# Altium project FX3U-14MR.PrjPcb (part 1 of 2)
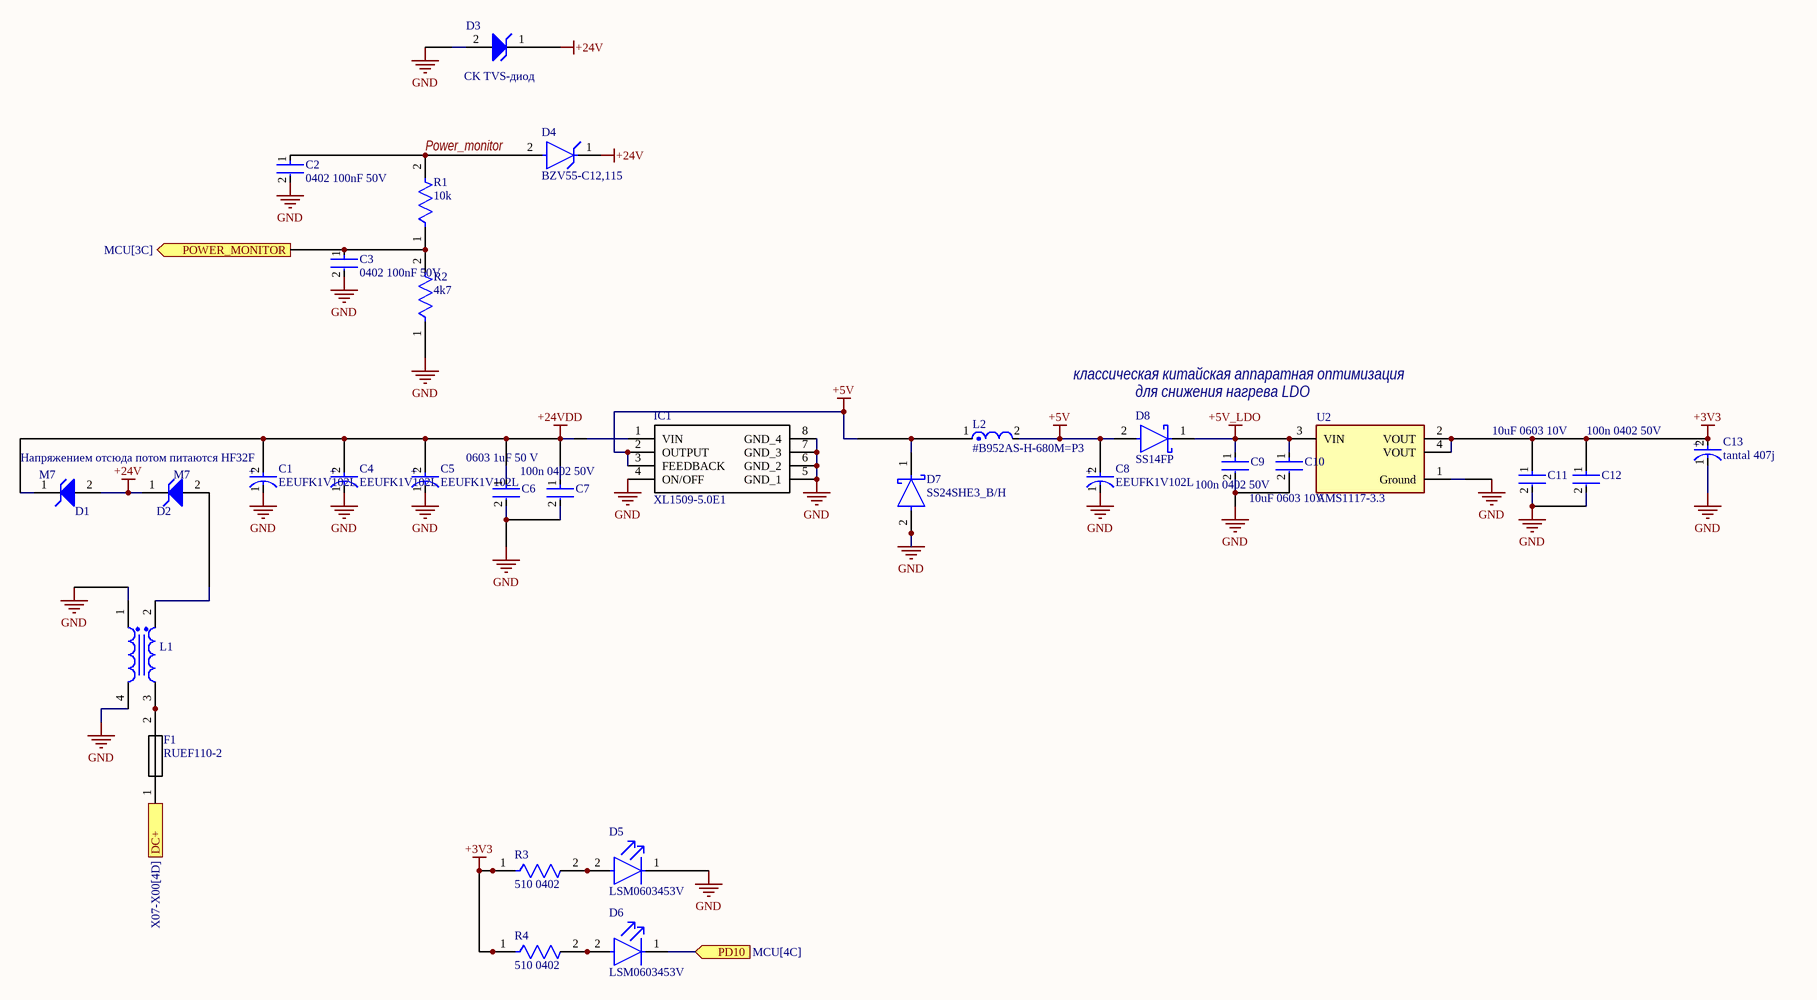
[diagram p0: Power_Supply.SchDoc]
6 sheets, 176 parts. Net scope: flat (ports and power ports of the same name join across sheets).
Board files: PCB.PcbDoc, PCB2.PcbDoc
Sheets:
  Power_Supply.SchDoc
  MCU.SchDoc
  RS232.SchDoc
  ULN2003.SchDoc
  DA0-1_AD0-AD5.SchDoc
  X07-X00.SchDoc

## Sheet Power_Supply.SchDoc
size A2; SheetNumber: 1; SheetTotal: 6

### Parts
C1  EEUFK1V102L  [FP-RAD-TH-D_10_0_5-L_30_2-MFG]
C2  0402 100nF 50V  [FP-0402B104K500CT-IPC_C]
C3  0402 100nF 50V  [FP-0402B104K500CT-IPC_C]
C4  EEUFK1V102L  [FP-RAD-TH-D_10_0_5-L_30_2-MFG]
C5  EEUFK1V102L  [FP-RAD-TH-D_10_0_5-L_30_2-MFG]
C6  0603 1uF 50 V  [FP-CC0603-DB-MFG]
C7  100n 0402 50V  [FP-0402B104K500CT-IPC_C]
C8  EEUFK1V102L  [FP-RAD-TH-D_10_0_5-L_30_2-MFG]
C9  100n 0402 50V  [FP-0402B104K500CT-IPC_C]
C10  10uF 0603 10V  [FP-C0603C106M8PACTU-MFG]
C11  10uF 0603 10V  [FP-C0603C106M8PACTU-MFG]
C12  100n 0402 50V  [FP-0402B104K500CT-IPC_C]
C13  tantal 407j  [FP-TPSB-MFG]
D1  M7  [WE-TVSP_DO-214AC_Unidirectional]
D2  M7  [WE-TVSP_DO-214AC_Unidirectional]
D3  CK TVS-диод  [WE-TVSP_DO-214AC_Unidirectional]
D4  BZV55-C12,115  [FP-SOD80C-MFG]
D5  LSM0603453V  [FP-LSM0603453V-MFG]
D6  LSM0603453V  [FP-LSM0603453V-MFG]
D7  SS24SHE3_B/H  [FP-95400-MFG]
D8  SS14FP  [FP-425AC-MFG]
F1  RUEF110-2  [RUEF1102]
IC1  XL1509-5.0E1  [SOIC127P600X175-8N]
L1  12mH  [WE-TFC_UU9.8V]  (value not drawn)
L2  #B952AS-H-680M=P3  [FP-DS104C2-MFG]
R1  10k  [FP-RT0603-MFG]
R2  4k7  [FP-MCR01-IPC_A]
R3  510 0402  [FP-RMCF0402-MFG]
R4  510 0402  [FP-RMCF0402-MFG]
U2  AMS1117-3.3  [FP-AMS1117-IPC_B]

### Ports
DC+ (in, see X07-X00[4D]), PD10 (in, see MCU[4C]), POWER_MONITOR (out, see MCU[3C])

### Nets
+3V3: C11.1 C12.1 C13.2(A) R3.1 R4.1 U2.2(VOUT) U2.4(VOUT)
+5V: C8.2(A) D7.1(C) D8.2(A) IC1.2(OUTPUT) IC1.3(FEEDBACK) L2.1 L2.2
+5V_LDO: C9.1 C10.1 D8.1(C) U2.3(VIN)
+24V: D1.2(A) D2.1(K) D3.1(K) D4.1(C)
+24VDD: C1.2(A) C4.2(A) C5.2(A) C6.1 C7.1 D1.1(K) IC1.1(VIN)
GND: C1.1(C) C2.2 C3.2 C4.1(C) C5.1(C) C6.2 C7.2 C8.1(C) C9.2 C10.2 C11.2 C12.2 C13.1(C) D3.2(A) D5.1(C) D7.2(A) IC1.4(ON/OFF) IC1.5(GND_1) IC1.6(GND_2) IC1.7(GND_3) IC1.8(GND_4) L1.1 L1.4 R2.1 U2.1(Ground)
Power_monitor: C2.1 D4.2(A) R1.2
NetC3_1: C3.1 R1.1 R2.2 ; port POWER_MONITOR
NetD2_2: D2.2(A) L1.2
NetD5_2: D5.2(A) R3.2
NetD6_1: D6.1(C) ; port PD10
NetD6_2: D6.2(A) R4.2
NetF1_1: F1.1 ; port DC+
NetF1_2: F1.2 L1.3

### Notes on the sheet
- классическая китайская аппаратная оптимизация
- для снижения нагрева LDO
- (near C1) Напряжением отсюда потом питаются HF32F
- (in symbol CMP-04424-000211-1) +
- (in symbol CMP-05427-000707-1) +

### Library data of the parts
C1 C4 C5 C8 = CMP-05427-000707-1: Aluminum Electrolytic Capacitors (Radial Lead Type) AEC-Q200 Qualified 1000uF ±20% 35V; Lead/Base Style: Straight; Ripple Current: 2.14A; Lead Diameter: 0.6mm; Dissipation Factor: 0.12%; Capacitance: 1mF; Life (Hours): 4000Hour; Dielectric Material: Aluminium; Tolerance: 20%; Height: 30mm; Max Operating Temperature: 105°C; Radiation Hardening: No; Voltage: 35V; Construction: RADIAL; Termination: Radial; Packaging: Bulk; Case/Package: Radial; Package Quantity: 100; Series: FK; Contact Plating: Tin; Voltage Rating (DC): 35V; Mount: Through Hole; RoHS Compliant: Yes; Diameter: 10mm; Lead Pitch: 5mm; REACH SVHC: No SVHC; Min Operating Temperature: -55°C; Voltage Rating: 35V; Length: 30mm
C2 C3 = CMP-45632-000010-1: CAP CER 0.1UF 50V X7R 0402; Tolerance: 10%; Max Operating Temperature: 125°C; Case Code (Metric): 1005; RoHS Compliant: Yes; Series: -; Case Code (Imperial): 0402; Voltage Rating: 50V; Min Operating Temperature: -55°C; Mount: Surface Mount; Capacitance: 100nF; Case/Package: 0402; Packaging: Cut Tape
C6 = CMP-03422-000761-2: CAP CER 1UF 50V X7R 0603; Tolerance: 10%; Lead Free: Lead Free; Max Operating Temperature: 125°C; Width: 0.031inch; Voltage Rating: 50V; Mount: Surface Mount; Resistor Type: Ceramic; Halogen Free: Halogen Free; Weight: 7.1E-05oz; Voltage Rating (DC): 50V; Package Quantity: 4000; Termination: SMD/SMT; Length: 0.063inch; Min Operating Temperature: -55°C; Dielectric: X7R; Case Code (Metric): 1608; Case Code (Imperial): 0603; Packaging: Tape and Reel; Thickness: 0.035inch; Capacitance: 1uF; Case/Package: 0603
C7 C9 C12 = CMP-45632-000010-1: CAP CER 0.1UF 50V X7R 0402; Tolerance: 10%; Capacitance: 100nF; Max Operating Temperature: 125°C; Case Code (Metric): 1005; RoHS Compliant: Yes; Series: -; Case Code (Imperial): 0402; Voltage Rating: 50V; Min Operating Temperature: -55°C; Mount: Surface Mount; Case/Package: 0402; Packaging: Cut Tape
C10 C11 = CMP-03020-034654-1: CAP CER 10UF 10V X5R 0603; RoHS Compliant: Yes
C13 = CMP-04424-000211-1: CAP TANT 100UF 10% 6.3V 1411; Dielectric Material: Tantalum; Leakage Current: 6.3uA; ESR (Equivalent Series Resistance): 400mR; Polarity: Polar; Packaging: Tape and Reel; Lead Free: Lead Free; RoHS Compliant: Yes; Case/Package: 1210; Mount: Surface Mount; Case Code (Metric): 3528; Depth: 2.8mm; Voltage Rating: 6.3V; REACH SVHC: No SVHC; Tolerance: 10%; Max Operating Temperature: 125°C; Package Quantity: 1; Height - Seated (Max): 0.083inch; Min Operating Temperature: -55°C; Case Code (Imperial): 1210; Capacitance: 100uF; Length: 3.5mm; Termination: SMD/SMT; Features: General Purpose; Voltage Rating (DC): 6.3V; Weight: 0.000564oz; Width: 0.11inch; Voltage: 6.3V; Construction: Flat; Series: TPS; Radiation Hardening: No; Height: 1.9mm; Dissipation Factor: 10%
D1 D2 = CMP-03913-71101534-2: Trans Voltage Suppressor Diode, 400W, Unidirectional, 1 Element, Silicon, DO-214AC; Clamping Voltage: 12V; Breakdown Voltage: 8.19V; Power Line Protection: No; Peak Pulse Current: 33.3A; Leakage Current: 200µA; Number of Unidirectional Channels: 1; Reverse Standoff Voltage: 7V; Peak Pulse Power: 400W; Max Operating Temperature: 150°C; Mount: Surface Mount; RoHS: Compliant; Min Breakdown Voltage: 8.19V; Composition: Zener; Min Operating Temperature: -65°C; Length: 4.24mm; Width: 2.67mm; Number of Pins: 2; REACH SVHC: Unknown; Max Breakdown Voltage: 8.19V; Packaging: Cut Tape; Polarity: Unidirectional; Height: 2.25mm
D3 = CMP-03913-71101519-2: TVS diode [Würth Elektronik] 824500281 TVS diode; Clamping Voltage: 45.4V; Polarity: Unidirectional; Reverse Standoff Voltage: 28V; Max Breakdown Voltage: 32.75V; Peak Pulse Power: 400W; Number of Unidirectional Channels: 1; Power Line Protection: No; Peak Pulse Current: 8.8A; Leakage Current: 1µA; Mount: Surface Mount; RoHS: Compliant; Composition: Zener; Number of Pins: 2; Packaging: Cut Tape; Height: 2.25mm; Max Operating Temperature: 150°C; Min Breakdown Voltage: 32.75V; Breakdown Voltage: 32.75V; REACH SVHC: Unknown; Length: 4.24mm; Min Operating Temperature: -65°C; Width: 2.67mm
D4 = CMP-14400-000013-1: DIODE ZENER 12V 500MW SOD80C; Manufacturer: Nexperia; Zener Impedance: 10Ω; Max Zener Voltage: 12.7V; Max Reverse Leakage Current: 0.1uA; Max Junction Temp: +200°C; Power Dissipation: 400mW; Forward Current: 250mA; Reverse Voltage: 8V; Device Class L1: Discrete Semiconductors; Octopart: https://octopart.com/bzv55-c12%2C115-nexperia-78739834; ComponentLink2Description: Datasheet; Automotive: No; ComponentLink2URL: https://assets.nexperia.com/documents/data-sheet/BZV55_SER.pdf; Height: 1.6mm; Lead Free: Yes; Temperature Range Low: -65°C; Mouser Description: Diode Zener Single 12.05V 5% 500mW 2-Pin Mini-MELF T/R; Device Class L3: Zener Diodes; Device Class L2: Diodes; Category: Diode; Package: SOD80C; Manufacturer Part Number: BZV55-C12,115; Footprint Url: https://assets.nexperia.com/documents/outline-drawing/SOD80C.pdf; RoHS: TRUE; Temperature Range High: +200°C; Digikey Description: DIODE ZENER 12V 500MW SOD80C; Nom Zener Voltage: 12V; Temperature: -65°C to +200°C
D5 D6 = CMP-00731-94024739-1: LSM0603453V LED SM 0603 3V -/1000/-mcd Green; Forward Current: 20mA; Forward Voltage: 2.3V; Viewing Angle: 120°; Reverse Voltage: 5V; Power Dissipation: 60mW; Wavelength: 576nm; Luminous Intensity: 120mcd; NexarPartId: 94024739; Height: 550µm; Max Operating Temperature: 85°C; Schedule B: 8541402000, 8541406050; Case/Package: 0603; Color: Green; Min Operating Temperature: -40°C
D7 = CMP-02539-000047-1: DIODE SCHOTTKY 2A 40V DO-214AC; RoHS Compliant: Yes
D8 = CMP-00278-84331602-1: SS14FP Diode Schottky 40V 1A 2-Pin SOD-123HE T/R - Tape and Reel; Manufacturer Lifecycle Status: ACTIVE; Max Junction Temperature (Tj): 150°C; Element Configuration: Single; Capacitance: 54pF; Max Forward Surge Current (Ifsm): 30A; Peak Reverse Current: 400µA; Reverse Recovery Time: 6ns; RoHS: Compliant; Min Operating Temperature: -55°C; Max Operating Temperature: 150°C; Lifecycle Status: Production; Forward Current: 1A; Average Rectified Current: 1A; Mount: Surface Mount; Height: 1mm; Max Repetitive Reverse Voltage (Vrrm): 40V; Weight: 18.4mg; NexarPartId: 84331602; Max Reverse Voltage (DC): 40V; Reverse Voltage: 40V; Schedule B: 8541100080, 8541100080
F1 = RUEF110-2: Fuse; Manufacturer_Name: LITTELFUSE; Datasheet Link: https://www.littelfuse.com/~/media/electronics/product_specifications/resettable_ptcs/littelfuse_ptc_ruef110_product_specification.pdf.pdf; Height: 14.2mm; Manufacturer_Part_Number: RUEF110-2; Mouser Part Number: 650-RUEF110-2; Mouser Price/Stock: https://www.mouser.co.uk/ProductDetail/Littelfuse/RUEF110-2?qs=k5V78Jg%2Feq5PDttMRR0ePQ%3D%3D; Arrow Part Number: RUEF110-2; Arrow Price/Stock: https://www.arrow.com/en/products/ruef110-2/littelfuse?region=nac
IC1 = XL1509-5.0E1: Integrated Circuit; Manufacturer_Name: XLSEMI; Datasheet Link: https://datasheet.lcsc.com/szlcsc/XLSEMI-XL1509-5-0E1_C61063.pdf; Height: 1.75mm; Manufacturer_Part_Number: XL1509-5.0E1
L1 = 744862120: WE-TFC THT Common Mode Power Line Choke, UU9.8V, 12mH, 0.4A, 2Ω; Manufacturer: Wurth Elektronik; Insulation Test Voltage (AC): 2500V; Material: MnZn; Rated Voltage (AC): 300V; ComponentLink1Description: Manufacturer Link; ComponentLink1URL: https://www.we-online.com/redexpert/article/744862120?ad; ComponentLink2Description: Datasheet; ComponentLink2URL: https://www.we-online.com/redexpert/spec/744862120?ad; Manufacturer Part Number: 744862120; Category: Common Mode Chokes; Match Code: WE-TFC; Mount: Through Hole; Operating Temperature Max: 125°C; Operating Temperature Min: -40°C; Packaging: Tray; Case/Size Code: UU9.8V; Length: 17mm; Width: 11.5mm; Height: 17mm; DC Resistance Max: 2Ω; Inductance: 12mH; Rated Current: 0.4A
L2 = CMP-06042-010777-1: Shielded Wirewound Inductor 68uH 20% 1100mA 0.24Ω SMD; Current Rating: 1.1A; Core Material: Ferrite; Test Frequency: 100kHz; DC Resistance (DCR): 240mR; Saturation Current: 1.3A; Width: 0.409inch; Packaging: Tape and Reel; Inductance: 68uH; Max Operating Temperature: 85°C; Case/Package: Nonstandard; Tolerance: 20%; Resistor Type: Wirewound; Mount: Surface Mount; Length: 0.409inch; Min Operating Temperature: -40°C; Height - Seated (Max): 0.19inch; Shielding: Shielded
R1 = CMP-03412-024743-1: RES SMD 10K OHM 0.05% 1/10W 0603; Manufacturer: Yageo; Manufacturer Part Number: RT0603WRE0710KL; Power Rating: 0.1W; Value: 10KΩ; Voltage Rating: 75V; Tolerance: 0.0005; Temperature Coefficient: 50 ppm/°C; Height: 0.55mm; ComponentLink2URL: http://www.yageo.com/documents/recent/PYu-RT_1-to-0.01_RoHS_L_9.pdf; Mouser Description: Res SMD 10K Ohm 0.05% 1/10W 0603; Device Class L1: Passive Components; Octopart: https://octopart.com/rt0603wre0710kl-yageo-71396825; Lead Free: Yes; RoHS: TRUE; ComponentLink2Description: Datasheet; Package: RT0603; Ipc Land Pattern Name: RESC16080X45; Automotive: No; Temperature: -55°C to +155°C; Series: RT; Resistance: 10KΩ; Footprint Url: http://www.yageo.com/exep/pages/download/literatures/PYu-R_Mount_10.pdf; Temperature Range Low: -55°C; Digikey Description: RES SMD 10K OHM 0.05% 1/10W 0603; Category: Res; Device Class L3: Chip SMD Resistors; Temperature Range High: +155°C; Device Class L2: Resistors; Composition: Thin Film
R2 = CMP-08839-002316-1: Thick Film Chip Resistor, 0402, 4.7kΩ, 1%, 100ppm/°C, 0.063W, 50V
R3 R4 = CMP-26527-001818-1: 510Ω ±1% 0.063W 0402 Thick Film Chip Resistor AEC-Q200 compliant; Temperature Coefficient: 100ppm/°C; Max Power Dissipation: 63mW; Resistance: 510R; Series: RMCF; RoHS Compliant: Yes; Features: Automotive AEC-Q200; Contact Plating: Tin; Case Code (Imperial): 0402; Package Quantity: 10000; Max Operating Temperature: 155°C; Height: 0.016inch; Length: 0.039inch; Width: 0.02inch; Number of Terminations: 2; Packaging: Tape and Reel; Mount: Surface Mount; Tolerance: 1%; Min Operating Temperature: -55°C; Case/Package: 0402; Case Code (Metric): 1005; Resistor Type: Thick Film
U2 = CMP-209535-000001-1: LDO Voltage Regulators 1A, 3.3V; Manufacturer: Advanced Monolithic Systems; Dropout Voltage: 1.1V; Output Type: Fixed; Nominal Supply Current: 5mA; Max Power Dissipation: 1.2W; Max Supply Voltage: 15V; Number Of Outputs: 1; Standoff Height: 0.64mm; Max Junction Temp: +125°C; Height: 1.8mm; Package: AMS1117; Device Class L2: Power Management ICs; ComponentLink2Description: Datasheet; ComponentLink2URL: http://www.advanced-monolithic.com/pdf/ds1117.pdf; Category: IC; RoHS: TRUE; Automotive: No; Device Class L1: Integrated Circuits (ICs); Output Current: 1A; Device Class L3: Voltage Regulators - Linear; Temperature: -40°C to +125°C; Output Voltage: 3.3V; Manufacturer Part Number: AMS1117-3.3; Temperature Range Low: -40°C; Octopart: https://octopart.com/ams1117-3.3-advanced+monolithic+systems-25899300; Lead Free: Yes; Ipc Land Pattern Name: SOT229P700X180-4; Temperature Range High: +125°C

## Sheet MCU.SchDoc
size A3; SheetNumber: 2; SheetTotal: 6
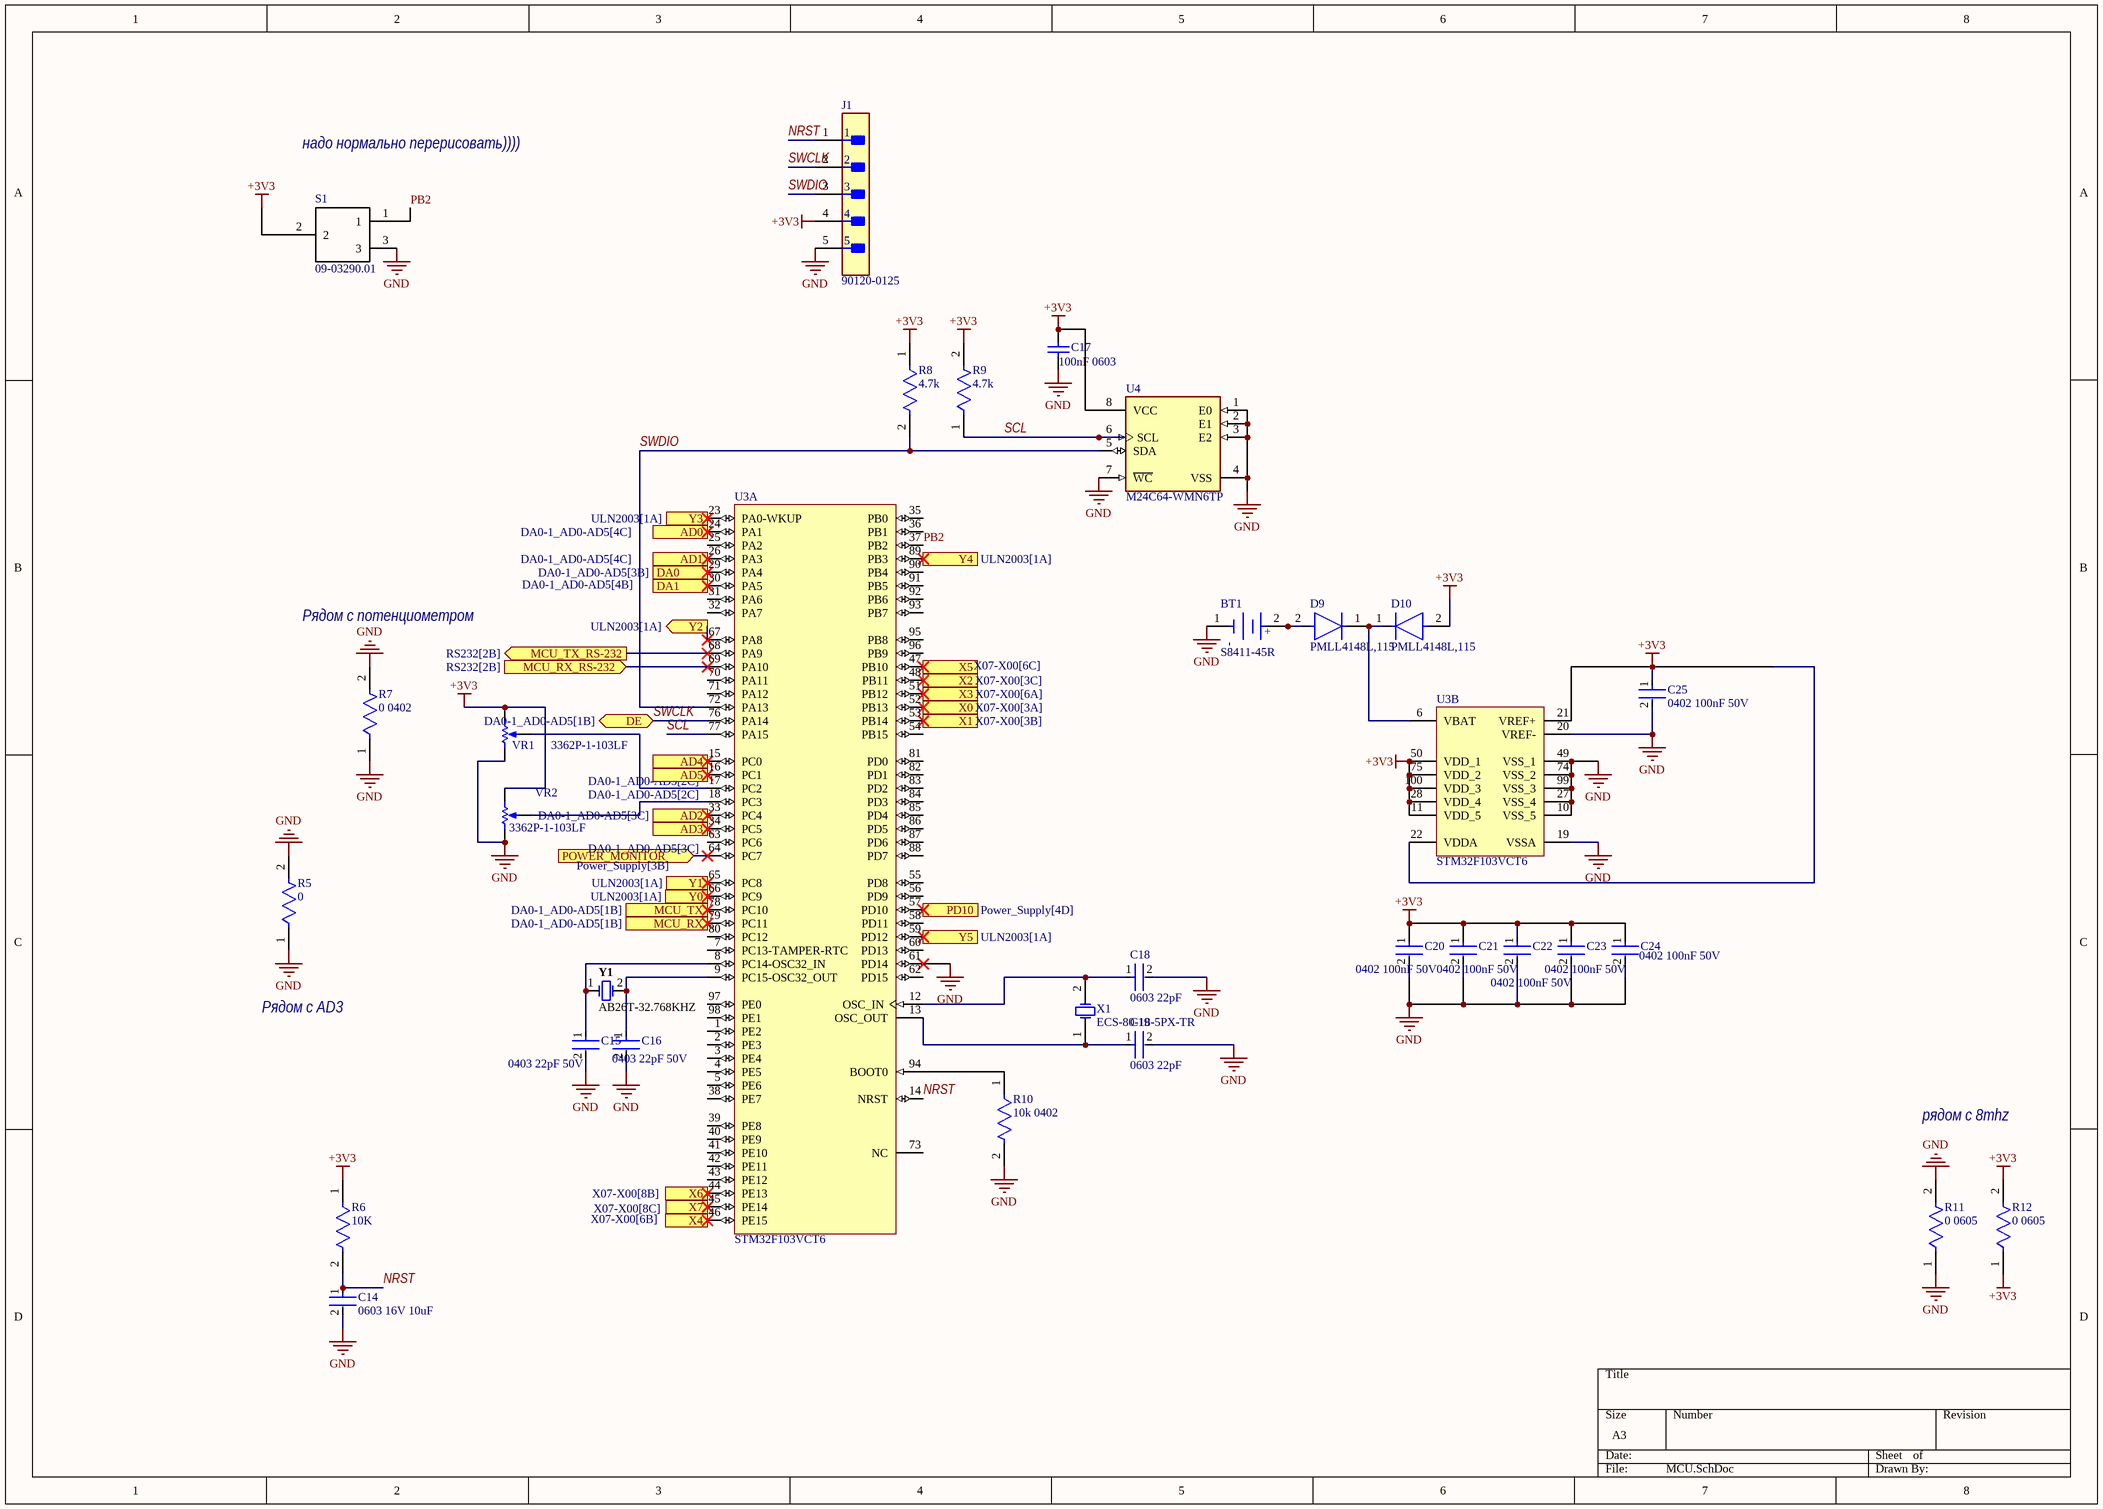
[diagram p1: MCU.SchDoc]

### Parts
BT1  S8411-45R  [FP-S8411-45R-MFG]
C14  0603 16V 10uF  [FP-CC0603-DC-MFG]
C15  0403 22pF 50V  [FP-C0402-BB-MFG]
C16  0403 22pF 50V  [FP-C0402-BB-MFG]
C17  100nF 0603  [CAPC1608X90X35LL15T15]
C18  0603 22pF  [FP-C0603C-CF-MFG]
C19  0603 22pF  [FP-C0603C-CF-MFG]
C20  0402 100nF 50V  [FP-0402B104K500CT-IPC_C]
C21  0402 100nF 50V  [FP-0402B104K500CT-IPC_C]
C22  0402 100nF 50V  [FP-0402B104K500CT-IPC_C]
C23  0402 100nF 50V  [FP-0402B104K500CT-IPC_C]
C24  0402 100nF 50V  [FP-0402B104K500CT-IPC_C]
C25  0402 100nF 50V  [FP-0402B104K500CT-IPC_C]
D9  PMLL4148L,115  [FP-SOD80C-MFG]
D10  PMLL4148L,115  [FP-SOD80C-MFG]
J1  90120-0125  [FP-90120-0125-MFG]
R5  0  [FP-RCS0603-e3-MFG]
R6  10K  [FP-RT0603-MFG]
R7  0 0402  [FP-PMR01-MFG]
R8  4.7k  [FP-TFCR0402-IPC_A]
R9  4.7k  [FP-TFCR0402-IPC_A]
R10  10k 0402  [FP-MCS0402-MFG]
R11  0 0605  [FP-HCJ0603-MFG]
R12  0 0605  [FP-HCJ0603-MFG]
S1  09-03290.01  [09.03290.01]
U3  STM32F103VCT6  [STM-LQFP100_L]  (parts A,B of 2)
U4  M24C64-WMN6TP  [FP-SO8N-SO-A-MFG]
VR1  3362P-1-103LF  [BOUR-3362P]
VR2  3362P-1-103LF  [BOUR-3362P]
X1  ECS-80-18-5PX-TR  [ECS-80-18-5PX-TR_V]
Y1  AB26T-32.768KHZ  [ABRA-AB26T]

### Ports
AD0 (in, see DA0-1_AD0-AD5[4C]), AD1 (in, see DA0-1_AD0-AD5[4C]), AD2 (in, see DA0-1_AD0-AD5[3C]), AD3 (in, see DA0-1_AD0-AD5[3C]), AD4 (in, see DA0-1_AD0-AD5[2C]), AD5 (in, see DA0-1_AD0-AD5[2C]), DA0 (out, see DA0-1_AD0-AD5[3B]), DA1 (out, see DA0-1_AD0-AD5[4B]), DE (bidir, see DA0-1_AD0-AD5[1B]), MCU_RX (in, see DA0-1_AD0-AD5[1B]), MCU_RX_RS-232 (in, see RS232[2B]), MCU_TX (out, see DA0-1_AD0-AD5[1B]), MCU_TX_RS-232 (out, see RS232[2B]), PD10 (out, see Power_Supply[4D]), POWER_MONITOR (in, see Power_Supply[3B]), X0 (in, see X07-X00[3A]), X1 (in, see X07-X00[3B]), X2 (in, see X07-X00[3C]), X3 (in, see X07-X00[6A]), X4 (in, see X07-X00[6B]), X5 (in, see X07-X00[6C]), X6 (in, see X07-X00[8B]), X7 (in, see X07-X00[8C]), Y0 (out, see ULN2003[1A]), Y1 (out, see ULN2003[1A]), Y2 (out, see ULN2003[1A]), Y3 (out, see ULN2003[1A]), Y4 (out, see ULN2003[1A]), Y5 (out, see ULN2003[1A])

### Nets
+3V3: C17.2 C20.1 C21.1 C22.1 C23.1 C24.1 C25.1 D10.2(A) J1.4 R6.1 R8.1 R9.2 R12.1 R12.2 S1.2 U3.11(VDD_5) U3.21(VREF+) U3.22(VDDA) U3.28(VDD_4) U3.50(VDD_1) U3.75(VDD_2) U3.100(VDD_3) U4.8(VCC) VR1.3(CW) VR2.3(CW)
GND: BT1.1(C) C14.2 C15.2 C16.2 C17.1 C18.2 C19.2 C20.2 C21.2 C22.2 C23.2 C24.2 C25.2 J1.5 R5.1 R5.2 R7.1 R7.2 R10.2 R11.1 R11.2 S1.3 U3.10(VSS_5) U3.19(VSSA) U3.20(VREF-) U3.27(VSS_4) U3.49(VSS_1) U3.61(PD14) U3.74(VSS_2) U3.99(VSS_3) U4.1(E0) U4.2(E1) U4.3(E2) U4.4(VSS) U4.7(~{WC}) VR1.1(CCW) VR2.1(CCW)
NRST: C14.1 J1.1 R6.2 U3.14(NRST)
PB2: S1.1 U3.37(PB2)
SCL: R9.1 U3.77(PA15) U4.6(SCL)
SWCLK: J1.2 U3.76(PA14) ; port DE
SWDIO: J1.3 R8.2 U3.72(PA13) U4.5(SDA)
NetBT1_2: BT1.2(A) D9.2(A)
NetC3_1: U3.64(PC7) ; port POWER_MONITOR
NetC15_1: C15.1 U3.8(PC14-OSC32_IN) Y1.1
NetC16_1: C16.1 U3.9(PC15-OSC32_OUT) Y1.2
NetC18_1: C18.1 U3.12(OSC_IN) X1.2(X2)
NetC19_1: C19.1 U3.13(OSC_OUT) X1.1(X1)
NetD6_1: U3.57(PD10) ; port PD10
NetD9_1: D9.1(C) D10.1(C) U3.6(VBAT)
NetD19_1: U3.52(PB13) ; port X0
NetD20_1: U3.53(PB14) ; port X1
NetD21_1: U3.48(PB11) ; port X2
NetD22_1: U3.51(PB12) ; port X3
NetD23_1: U3.46(PE15) ; port X4
NetD24_1: U3.47(PB10) ; port X5
NetD25_1: U3.44(PE13) ; port X6
NetD26_1: U3.45(PE14) ; port X7
NetR10_1: R10.1 U3.94(BOOT0)
NetR21_1: U3.16(PC1) ; port AD5
NetR25_1: U3.15(PC0) ; port AD4
NetR30_1: U3.34(PC5) ; port AD3
NetR33_1: U3.29(PA4) ; port DA0
NetR34_2: U3.33(PC4) ; port AD2
NetR39_1: U3.26(PA3) ; port AD1
NetR41_2: U3.30(PA5) ; port DA1
NetR42_1: U3.24(PA1) ; port AD0
NetU3_17: U3.17(PC2) VR1.2(S)
NetU3_18: U3.18(PC3) VR2.2(S)
NetU3_23: U3.23(PA0-WKUP) ; port Y3
NetU3_59: U3.59(PD12) ; port Y5
NetU3_65: U3.65(PC8) ; port Y1
NetU3_66: U3.66(PC9) ; port Y0
NetU3_67: U3.67(PA8) ; port Y2
NetU3_68: U3.68(PA9) ; port MCU_TX_RS-232
NetU3_69: U3.69(PA10) ; port MCU_RX_RS-232
NetU3_78: U3.78(PC10) ; port MCU_TX
NetU3_79: U3.79(PC11) ; port MCU_RX
NetU3_89: U3.89(PB3) ; port Y4

Not connected (* = marked no-connect by the designer): U3 1(PE2) 2(PE3) 3(PE4) 4(PE5) 5(PE6) 7(PC13-TAMPER-RTC) 25(PA2) 31(PA6) 32(PA7) 35(PB0) 36(PB1) 38(PE7) 39(PE8) 40(PE9) 41(PE10) 42(PE11) 43(PE12) 54(PB15) 55(PD8) 56(PD9) 58(PD11) 60(PD13) 62(PD15) 63(PC6) 70(PA11) 71(PA12) 73(NC) 80(PC12) 81(PD0) 82(PD1) 83(PD2) 84(PD3) 85(PD4) 86(PD5) 87(PD6) 88(PD7) 90(PB4) 91(PB5) 92(PB6) 93(PB7) 95(PB8) 96(PB9) 97(PE0) 98(PE1)

### Notes on the sheet
- надо нормально перерисовать))))
- Рядом с потенциометром
- Рядом с AD3
- рядом с 8mhz
- (in symbol CMP-15817-000007-1) +; -

### Library data of the parts
BT1 = CMP-15817-000007-1: BATTERY HOLDER COIN 12MM SMD; Number of Batteries: 1; Material: Polyphenylene; Case/Package: SMD/SMT; Number of Cells: 1; Min Operating Temperature: -55°C; Termination: SMD/SMT; REACH SVHC: No SVHC; Contact Plating: Bronze; Package Quantity: 500; Max Operating Temperature: 105°C; Mount: Surface Mount; Packaging: Tape and Reel
C14 = CMP-00621-81932632-1: CC0603KRX5R7BB106 Multilayer Ceramic Capacitor, 10 uF, 16 V, ± 10%, X5R, 0603 [1608 Metric]; Capacitance: 10µF; NexarPartId: 81932632; Height: 1mm; Halogen Free: Halogen Free; Voltage Rating: 16V; Dielectric: X5R; Max Operating Temperature: 85°C; Voltage Rating (DC): 16V; Material: Ceramic; Lead Free: Lead Free; Tolerance: 10%; RoHS: Non-Compliant; Min Operating Temperature: -55°C; Case/Package: 0603
C15 C16 = CMP-03020-023432-1: C0402 22 pF C0G 5.00% 50 V; Manufacturer: Kemet; Manufacturer Part Number: C0402C220J5GAC; Tolerance: 0.05; Temperature Coefficient: 15%; Material: Ceramic; Lead Free: Yes; Package: C0402-BB; Device Class L3: Ceramic Capacitors; Mouser Description: Cap Ceramic 22pF 50V C0G 5% Pad SMD 0402 125C Bulk; Ipc Land Pattern Name: CAPC10050X50; Device Class L2: Capacitors; Device Class L1: Passive Components; Height: 0.55mm; Temperature Characteristic: C0G; Voltage Rating: 50 V; Automotive: No; ComponentLink2Description: Datasheet; Capacitance: 22 pF; Temperature Range Low: -55°C; Category: Cap; Value: 22 pF; Temperature: -55°C to +125°C; Octopart: https://octopart.com/c0402c220j5gac-kemet-3919113; RoHS: TRUE; ComponentLink2URL: https://content.kemet.com/datasheets/KEM_C1002_X7R_SMD.pdf; Temperature Range High: +125°C
C17 = CMP-2006-04391-1: Manufacturer: AVX Interconnect / Elco; Part Number: 06035C104KAZ2A
C18 C19 = CMP-03020-000148-1: C0603 22 pF X7R 30ppm/°C 5.00% 50 V; Manufacturer: KEMET; Manufacturer Part Number: C0603C220J5RACTU; Automotive Grade: Grade 1; Voltage Rating: 50 V; Tolerance: 0.05; Material: Ceramic; ComponentLink2Description: Datasheet; RoHS: TRUE; Octopart: https://octopart.com/c0603c220j5ractu-kemet-47052364; Temperature Range High: +125°C; Lead Free: Yes; Temperature Range Low: -55°C; Category: Cap; Automotive: Yes; Value: 22 pF; Package: C0603C-CF; Device Class L3: Ceramic Capacitors; Device Class L1: Passive Components; Temperature Characteristic: X7R; Capacitance: 22 pF; Device Class L2: Capacitors; Temperature: -55°C to +125°C; Height: 0.87mm; Temperature Coefficient: 30ppm/°C; ComponentLink2URL: https://api.kemet.com/component-edge/download/datasheet/C0603C100J5GACAUTO.pdf
C20-C25 = CMP-45632-000010-1: as C2 on sheet Power_Supply; Max Operating Temperature: 125°C; Case Code (Metric): 1005; RoHS Compliant: Yes; Series: -; Case Code (Imperial): 0402; Voltage Rating: 50V; Min Operating Temperature: -55°C; Mount: Surface Mount; Capacitance: 100nF; Case/Package: 0402; Packaging: Cut Tape
D9 D10 = CMP-14399-000003-1: DIODE GEN PURP 75V 200MA LLDS; Manufacturer: Nexperia; Max Junction Temp: +200°C; Capacitance: 4pF; Peak Reverse Current: 0.025uA; Value: 4pF; Max Surge Forward Current: 0.5A; Max Repetitive Reverse Voltage: 100V; Ambient Temperature Range Low: -65°C; Octopart: https://octopart.com/pmll4148l%2C115-nexperia-78741557; ComponentLink2URL: https://assets.nexperia.com/documents/data-sheet/PMLL4148L_PMLL4448.pdf; Ambient Temperature Range High: +200°C; Reverse Voltage: 75V; Device Class L2: Diodes; Height: 1.6mm; Package: SOD80C; Device Class L1: Discrete Semiconductors; Digikey Description: DIODE GEN PURP 75V 200MA LLDS; Lead Free: Yes; Manufacturer Part Number: PMLL4148L,115; Temperature Range High: +200°C; Forward Current: 200mA; ComponentLink2Description: Datasheet; Device Class L3: Rectifier Diodes; Temperature: to +200°C; Automotive: No; RoHS: TRUE; Category: Diode; Footprint Url: https://assets.nexperia.com/documents/outline-drawing/SOD80C.pdf
J1 = CMP-00257-00655425-1: 90120-0125 2.54mm Pitch C-Grid III Header, Single Row, Vertical, 5 Circuits, Tin (Sn) Plating; NexarPartId: 655425; Manufacturer Lifecycle Status: ACTIVE; Lead Length: 2.9mm; Number of Positions: 5; Current Rating: 3A; Mating Post Length: 6.75mm; Glow Wire Compliant: Non-compliant; Contact Resistance: 20mΩ; Voltage Rating: 350V; Gender: Male; Max Voltage Rating (DC): 350.35kV; Max Operating Temperature: 125°C; Number of Pins: 5; Plating: Tin; Contact Material: Brass; Mount: Through Hole; Contact Gender: Male; Packaging: Bulk; Schedule B: 8536694040; Lifecycle Status: Production; Lead Pitch: 2.54mm; Radiation Hardening: No; Orientation: Vertical; Min Operating Temperature: -55°C; Country of Origin: SK; Housing Color: Black; REACH SVHC: No SVHC; Contact Plating: Tin; Number of Rows: 1; Number of Circuits: 5; Termination: Solder; Number of Contacts: 5; Pitch: 2.54mm; Housing Material: Polyester; RoHS: Compliant; Lead Free: Lead Free; Voltage Rating (AC): 350V
R5 = CMP-02407-013117-1: RES SMD 0 OHM JUMPER 1/4W 0603; Max Power Dissipation: 250mW; Resistance: 0R; Case Code (Metric): 1608; Packaging: Cut Tape; RoHS Compliant: Yes; Ratings: AEC-Q200; Max Operating Temperature: 155°C; Resistor Type: Thick Film; Features: Automotive AEC-Q200; Case Code (Imperial): 0603; Number of Terminations: 2; Min Operating Temperature: -55°C; Width: 0.033inch; Height: 0.02inch; Series: RCS e3; Length: 0.061inch; Case/Package: 0603
R6 = CMP-03412-024743-1: as R1 on sheet Power_Supply; Height: 0.55mm; ComponentLink2URL: http://www.yageo.com/documents/recent/PYu-RT_1-to-0.01_RoHS_L_9.pdf; Mouser Description: Res SMD 10K Ohm 0.05% 1/10W 0603; Device Class L1: Passive Components; Octopart: https://octopart.com/rt0603wre0710kl-yageo-71396825; Lead Free: Yes; RoHS: TRUE; ComponentLink2Description: Datasheet; Package: RT0603; Ipc Land Pattern Name: RESC16080X45; Automotive: No; Temperature: -55°C to +155°C; Series: RT; Resistance: 10KΩ; Footprint Url: http://www.yageo.com/exep/pages/download/literatures/PYu-R_Mount_10.pdf; Temperature Range Low: -55°C; Digikey Description: RES SMD 10K OHM 0.05% 1/10W 0603; Category: Res; Device Class L3: Chip SMD Resistors; Temperature Range High: +155°C; Device Class L2: Resistors; Composition: Thin Film
R7 = CMP-08839-031884-1: RES SMD 0 OHM JUMPER 1/5W 0402; Temperature Coefficient: 200ppm/°C; Resistance: 0mR; Max Power Dissipation: 200mW; Case/Package: 0402; Max Operating Temperature: 155°C; Features: Automotive AEC-Q200; Packaging: Tape and Reel; Case Code (Imperial): 0402; Height: 0.01inch; Number of Terminations: 2; Case Code (Metric): 1005; Resistor Type: Thick Film; Length: 0.039inch; RoHS Compliant: Yes; Min Operating Temperature: -55°C; Width: 0.02inch
R8 R9 = CMP-250906-194630-1: RES Thin Film,  4.7kΩ, 0.5%, 0.063W, 25ppm/°C, 0402
R10 = CMP-02407-000363-1: RES SMD 1.2K OHM 1% 1/10W 0402; Power Rating: 100mW; Temperature Coefficient: 25ppm/°C; Tolerance: 0.5%; Voltage Rating: 50V; Resistance: 10kR; Package Quantity: 10000; Case Code (Metric): 1005; Height: 0.015inch; Termination: SMD/SMT; Features: Automotive AEC-Q200; Packaging: Tape and Reel; Length: 0.039inch; Min Operating Temperature: -55°C; Case/Package: 0402; Max Power Dissipation: 100mW; Case Code (Imperial): 0402; Width: 0.5mm; Contact Plating: Tin; Weight: 2.1E-05oz; Max Operating Temperature: 175°C; Composition: Thin Film; Number of Terminations: 2; Radiation Hardening: No
R11 R12 = CMP-26527-000122-1: RES 0 OHM JUMPER 1/4W 0603; Resistance: 0mR; Termination: Wraparound; Mount: Surface Mount; Min Operating Temperature: -55°C; Number of Terminations: 2; Packaging: Tape and Reel; Case Code (Imperial): 0603; Height: 0.021inch; RoHS Compliant: Yes; Width: 0.031inch; Package Quantity: 5000; Max Operating Temperature: 155°C; Radiation Hardening: No; Case/Package: 0603; Length: 0.061inch; Case Code (Metric): 1608
S1 = 09-03290.01: Switch; Manufacturer_Name: EOZ; Manufacturer_Part_Number: 09-03290.01
U3 = CMP-0237-00164-3: ARM Cortex-M3 32-bit MCU, 256 KB Flash, 48 KB Internal RAM, 80 I/Os, 100-pin LQFP, -40 to 85 degC, Tray; FLASH Size (Prog) (kB): 256; I/Os (High Current): 80; Supply Voltage(Vcc) min (V): 2; Operating Frequency(F) (Processor speed) (MHz): 72; Internal RAM Size (kB): 48; A/D Converter: 3x12-bit (16 Channel); D/A Converter: 2x12-bit (2 Channel); PartNumber: STM32F103VCT6; ComponentLink2URL: http://www.st.com/st-web-ui/static/active/en/resource/technical/document/datasheet/CD00191185.pdf; Packing: Tray; ComponentLink3Description: Package Specification; PackageReference: LQFP100; ComponentLink1Description: Manufacturer URL; ComponentLink2Description: Datasheet; PackageDescription: 100-Pin Low Profile Quad Flat Package, 14 x 14 mm Body, 0.5 mm Pitch; DatasheetVersion: Rev. 8; Core: ARM Cortex-M3; ComponentLink1URL: http://www.st.com/web/en/home.html; ComponentLink3URL: http://www.st.com/st-web-ui/static/active/en/resource/technical/document/data_brief/DM00071938.pdf; Mounting Technology: Surface Mount; PackageVersion: Rev. 1, 06/2013
U4 = CMP-12142-000011-1: IC EEPROM 64K I2C 1MHZ 8SO; Manufacturer: STMicroelectronics; Max Supply Voltage: 5.5V; Nominal Supply Current: 2-2.5mA; Min Supply Voltage: 2.5V; Standoff Height: 0.1mm; Memory Size: 64Kbits; Access Time: 900ns; Temperature Range High: +85°C; Mouser Description: EEPROM EEPROM S. I2C 64k; Height: 1.75mm; ComponentLink2Description: Datasheet; Package: SO8N-SO-A; Ipc Land Pattern Name: SOIC127P600X175-8; Lead Free: Yes; Manufacturer Part Number: M24C64-WMN6TP; Temperature Range Low: -40°C; Category: IC; Octopart: https://octopart.com/m24c64-wmn6tp-stmicroelectronics-55412559; Temperature: -40°C to +85°C; Memory Type: EEPROM; Device Class L2: Memory; ComponentLink2URL: https://www.st.com/content/ccc/resource/technical/document/datasheet/5c/df/52/a5/15/f2/48/bd/CD00259166.pdf/files/CD00259166.pdf/jcr:content/translations/en.CD00259166.pdf; Interface: I2C; Frequency: 1MHz; Ambient Temperature Range Low: -40°C; Digikey Description: IC EEPROM 64K I2C 1MHZ 8SO; Device Class L3: EEPROM; Automotive: No; Ambient Temperature Range High: +85°C; Device Class L1: Integrated Circuits (ICs); RoHS: TRUE
VR1 VR2 = CMP-1747-00004-1: Square Trimpot(R) Trimming Potentiometer, 10 KOhm, 300 V, -55 to 125 degC, 3-Pin THD, RoHS, Tube; Voltage Rating: 220 mV; Power Rating: 1 W; Tolerance: 1%; Resistance: 50 mohm; Case/Package: 1206; Length: 3.2 mm; RoHSCompliant: True; PackageDescription: 3-Pin Through Hole Device, Body 6.6 x 6.99 mm, Pitch 2.54 mm; ComponentLink2Description: Datasheet; REACH SVHC: No SVHC; Mount: Surface Mount; Height: 0.6 mm; Packaging: Tape and Reel; ComponentLink1URL: http://www.bourns.com/; Case Code (Imperial): 0612; Pins: 2; Case Code (Metric): 1632; ComponentLink2URL: http://www.bourns.com/docs/Product-Datasheets/3362.pdf; Min Operating Temperature: -25degC; ComponentLink1Description: Manufacturer URL; PackageReference: 3326P; Max Operating Temperature: 125degC; Width: 1.6 mm; Package Quantity: 5000; DatasheetVersion: May-16
X1 = CMP-2000-06193-1: Low Profile Quartz Crystal, 8.0 MHz, 2-Pin SMD, RoHS, Tape and Reel; Brand: ECS; Tolerance: 30PPM; Case Height: 4.3mm; Frequency: 8MHz; Frequency Stability: 50PPM; Case Length: 13.2mm; Case Width: 4.8mm; Load Capacitance: 18pF; Termination Style: SMD/SMT; Product Category: Crystals; Packaging: Reel; Package Reference: ECS-80-18-5PX-TR; Mounting Technology: SurfaceMount; Dimensions: 4.8mmWx13.2mmLx4.3mmH; Package Description: 2-Pin Surface Mount Device, Body 11.4 x 4.8 mm, Height 4.3 mm; Datasheet URL: https://www.ecsxtal.com/store/pdf/csm-7x.pdf; Datasheet Version: 05/2016; Manufacturer: ECS; Factory Pack Quantity: 1000; Manufacturer URL: https://www.ecsxtal.com/; Type: SMDQuartzCrystals; Mounting Style: SMD/SMT; Package / Case: HC-49/US; Operating Temperature Range: -10Cto+70C; RoHS: Details; Series: CSM-7X
Y1 = CMP-2000-05723-1: Crystal, 12.5 pF, 32.768 KHz, -10 to 60 degC, 2-Pin THD, RoHS, Bulk; Manufacturer: ABRACON; ESR: 35kOhms; Frequency Stability: -0.034PPM; Load Capacitance: 12.5pF; Tolerance: 20PPM; Case Length: 6.2mm; Case Diameter: 2.1mm; RoHS: Details; Product Category: Crystals; Type: WatchCrystal; Manufacturer URL: http://www.abracon.com/; Operating Temperature Range: -10Cto+60C; Package Description: 2-Pin Through Hole Device, Dia 2.1 mm, Body Length 6.2 mm; Termination Style: Radial; Datasheet Version: 06/2010; Datasheet URL: http://www.abracon.com/Resonators/AB26T.pdf; Packaging: Bulk; Factory Pack Quantity: 500; Brand: ABRACON; Mounting Technology: ThroughHole; Package URL: http://www.abracon.com/Support/PackageDrawing/Resonators/AB26T.PDF; Package / Case: Cylinder; Lead Spacing: 0.8mm; Dimensions: 2.1mmDia.x6.2mmL; Mounting Style: ThroughHole; Frequency: 32.768kHz; Package Reference: AB26T; Series: AB26T

## Sheet RS232.SchDoc
size A4; SheetNumber: 3; SheetTotal: 6
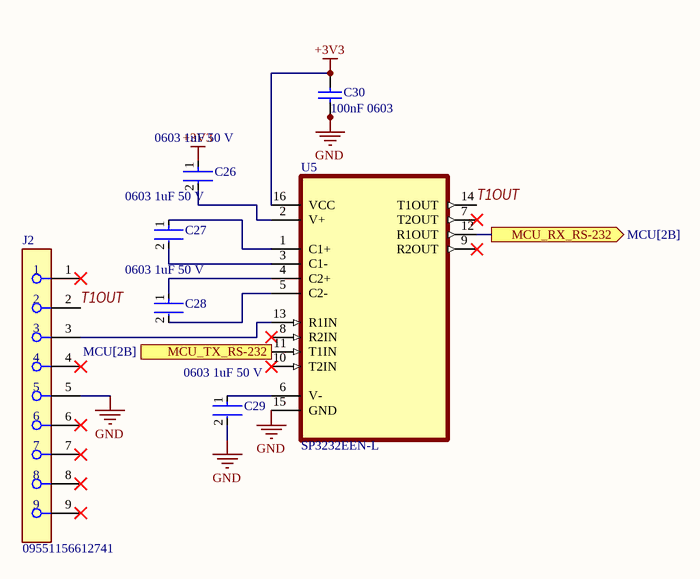
[diagram p2: RS232.SchDoc]

### Parts
C26  0603 1uF 50 V  [FP-CC0603-DB-MFG]
C27  0603 1uF 50 V  [FP-CC0603-DB-MFG]
C28  0603 1uF 50 V  [FP-CC0603-DB-MFG]
C29  0603 1uF 50 V  [FP-CC0603-DB-MFG]
C30  100nF 0603  [CAPC1608X90X35LL15T15]
J2  09551156612741  [FP-09551156612741-MFG]
U5  SP3232EEN-L  [SOIC127P600X175-16N]

### Ports
MCU_RX_RS-232 (out, see MCU[2B]), MCU_TX_RS-232 (in, see MCU[2B])

### Nets
+3V3: C26.1 C30.2 U5.16(VCC)
GND: C29.2 C30.1 J2.5 U5.15(GND)
T1OUT: J2.2 U5.14(T1OUT)
NetC26_2: C26.2 U5.2(V+)
NetC27_1: C27.1 U5.1(C1+)
NetC27_2: C27.2 U5.3(C1-)
NetC28_1: C28.1 U5.4(C2+)
NetC28_2: C28.2 U5.5(C2-)
NetC29_1: C29.1 U5.6(V-)
NetJ2_3: J2.3 U5.13(R1IN)
NetU3_68: U5.11(T1IN) ; port MCU_TX_RS-232
NetU3_69: U5.12(R1OUT) ; port MCU_RX_RS-232

Not connected (* = marked no-connect by the designer): J2 1* 4* 6* 7* 8* 9*; U5 7(T2OUT)* 8(R2IN)* 9(R2OUT)* 10(T2IN)*

### Library data of the parts
C26-C29 = CMP-03422-000761-2: CAP CER 1UF 50V X7R 0603; Tolerance: 10%; Lead Free: Lead Free; Max Operating Temperature: 125°C; Width: 0.031inch; Voltage Rating: 50V; Mount: Surface Mount; Resistor Type: Ceramic; Halogen Free: Halogen Free; Weight: 7.1E-05oz; Voltage Rating (DC): 50V; Package Quantity: 4000; Termination: SMD/SMT; Length: 0.063inch; Min Operating Temperature: -55°C; Dielectric: X7R; Case Code (Metric): 1608; Case Code (Imperial): 0603; Packaging: Tape and Reel; Thickness: 0.035inch; Capacitance: 1uF; Case/Package: 0603
C30 = CMP-2006-04391-1: as C17 on sheet MCU
J2 = CMP-33115-000006-1: CONN D-SUB RCPT 9POS SMD SLDR; Number of Positions: 9; Gender: Receptacle; Body Material: Steel; Pitch: 2.74mm; Current Rating: 5A; Mating Cycles: 250; Number of Contacts: 9; Color: Black; Contact Plating: Gold; Mount: Surface Mount; Housing Material: Polymer; Termination: Solder; Depth: 12.25mm; Max Operating Temperature: 125°C; Length: 31.12mm; Number of Rows: 2; RoHS Compliant: Yes; Min Operating Temperature: -55°C; Contact Material: Bronze; Width: 12.5mm; Packaging: Tape and Reel; Orientation: Straight; REACH SVHC: No SVHC; Connector Type: D-Sub
U5 = SP3232EEN-L: 2/2 Transceiver Full RS232 16-SOIC; MF: MaxLinear, Inc.; SnapEDA_Link: https://www.snapeda.com/parts/SP3232EEN-L/MaxLinear/view-part/?ref=snap; Package: SOIC-16 Exar; Value: *; MP: SP3232EEN-L; Check_prices: https://www.snapeda.com/parts/SP3232EEN-L/MaxLinear/view-part/?ref=eda

## Sheet ULN2003.SchDoc
size A4; SheetNumber: 4; SheetTotal: 6
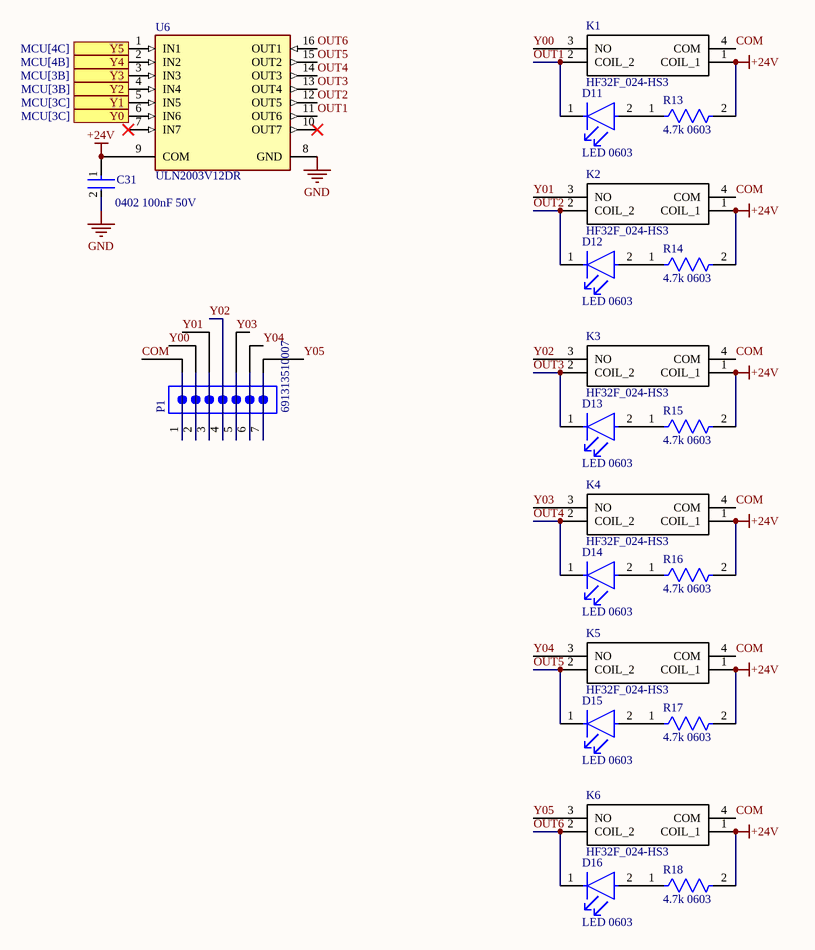
[diagram p3: ULN2003.SchDoc]

### Parts
C31  0402 100nF 50V  [FP-0402B104K500CT-IPC_C]
D11  LED 0603  [FP-LSM0603453V-MFG]
D12  LED 0603  [FP-LSM0603453V-MFG]
D13  LED 0603  [FP-LSM0603453V-MFG]
D14  LED 0603  [FP-LSM0603453V-MFG]
D15  LED 0603  [FP-LSM0603453V-MFG]
D16  LED 0603  [FP-LSM0603453V-MFG]
K1  HF32F_024-HS3  [HF32F024HS3]
K2  HF32F_024-HS3  [HF32F024HS3]
K3  HF32F_024-HS3  [HF32F024HS3]
K4  HF32F_024-HS3  [HF32F024HS3]
K5  HF32F_024-HS3  [HF32F024HS3]
K6  HF32F_024-HS3  [HF32F024HS3]
P1  691313510007  [691313510007]
R13  4.7k 0603  [FP-AC0603-MFG]
R14  4.7k 0603  [FP-AC0603-MFG]
R15  4.7k 0603  [FP-AC0603-MFG]
R16  4.7k 0603  [FP-AC0603-MFG]
R17  4.7k 0603  [FP-AC0603-MFG]
R18  4.7k 0603  [FP-AC0603-MFG]
U6  ULN2003V12DR  [FP-D0016A-MFG]

### Ports
Y0 (in, see MCU[3C]), Y1 (in, see MCU[3C]), Y2 (in, see MCU[3B]), Y3 (in, see MCU[3B]), Y4 (in, see MCU[4B]), Y5 (in, see MCU[4C])

### Nets
+24V: C31.1 K1.1(COIL_1) K2.1(COIL_1) K3.1(COIL_1) K4.1(COIL_1) K5.1(COIL_1) K6.1(COIL_1) R13.2 R14.2 R15.2 R16.2 R17.2 R18.2 U6.9(COM)
GND: C31.2 U6.8(GND)
COM: K1.4(COM) K2.4(COM) K3.4(COM) K4.4(COM) K5.4(COM) K6.4(COM) P1.1
OUT1: D11.1(C) K1.2(COIL_2) U6.11(OUT6)
OUT2: D12.1(C) K2.2(COIL_2) U6.12(OUT5)
OUT3: D13.1(C) K3.2(COIL_2) U6.13(OUT4)
OUT4: D14.1(C) K4.2(COIL_2) U6.14(OUT3)
OUT5: D15.1(C) K5.2(COIL_2) U6.15(OUT2)
OUT6: D16.1(C) K6.2(COIL_2) U6.16(OUT1)
Y00: K1.3(NO) P1.2
Y01: K2.3(NO) P1.3
Y02: K3.3(NO) P1.4
Y03: K4.3(NO) P1.5
Y04: K5.3(NO) P1.6
Y05: K6.3(NO) P1.7
NetD11_2: D11.2(A) R13.1
NetD12_2: D12.2(A) R14.1
NetD13_2: D13.2(A) R15.1
NetD14_2: D14.2(A) R16.1
NetD15_2: D15.2(A) R17.1
NetD16_2: D16.2(A) R18.1
NetU3_23: U6.3(IN3) ; port Y3
NetU3_59: U6.1(IN1) ; port Y5
NetU3_65: U6.5(IN5) ; port Y1
NetU3_66: U6.6(IN6) ; port Y0
NetU3_67: U6.4(IN4) ; port Y2
NetU3_89: U6.2(IN2) ; port Y4

Not connected (* = marked no-connect by the designer): U6 7(IN7)* 10(OUT7)*

### Library data of the parts
C31 = CMP-45632-000010-1: as C2 on sheet Power_Supply; Max Operating Temperature: 125°C; Case Code (Metric): 1005; RoHS Compliant: Yes; Series: -; Case Code (Imperial): 0402; Voltage Rating: 50V; Min Operating Temperature: -55°C; Mount: Surface Mount; Capacitance: 100nF; Case/Package: 0402; Packaging: Cut Tape
D11-D16 = CMP-00731-94024739-1: as D5 on sheet Power_Supply; NexarPartId: 94024739; Height: 550µm; Max Operating Temperature: 85°C; Schedule B: 8541402000, 8541406050; Case/Package: 0603; Color: Green; Min Operating Temperature: -40°C
K1-K6 = HF32F_024-HS3: Relay or Contactor; Manufacturer_Name: Hongfa; Manufacturer_Part_Number: HF32F/024-HS3; Datasheet Link: https://source.hongfa.com//Api/DownloadPdf/265; Height: 15.8mm
P1 = CMP-1502-02197-3: Terminal Block, 5.08MM Pitch, Close Horizontal Pcb Header, 300VAC, 7 Pins
R13-R18 = CMP-03412-049129-1: RES 4.7kΩ 1.00% 0.2W 0603
U6 = CMP-04912-000075-1: MOSFET 7CH 16SOIC; Power Dissipation: 860mW; Output Current: 140mA; Collector Emitter Voltage (VCEO): 20V; Collector Emitter Saturation Voltage: 750mV; Output Voltage: 16V; Number of Drivers: 7; Number of Pins: 16; RoHS Compliant: Yes; Height: 1.5mm; Package Quantity: 1; REACH SVHC: No SVHC; Series: -; Min Operating Temperature: -40°C; Max Power Dissipation: 860mW; Max Collector Current: 140mA; Mount: Surface Mount; Packaging: Tape and Reel; Radiation Hardening: No; Case/Package: SOIC; Max Operating Temperature: 85°C; Number of Outputs: 7; Lead Free: Lead Free; Width: 4mm; Weight: 0.004998oz; Length: 10mm

## Sheet DA0-1_AD0-AD5.SchDoc
size A4; SheetNumber: 5; SheetTotal: 6
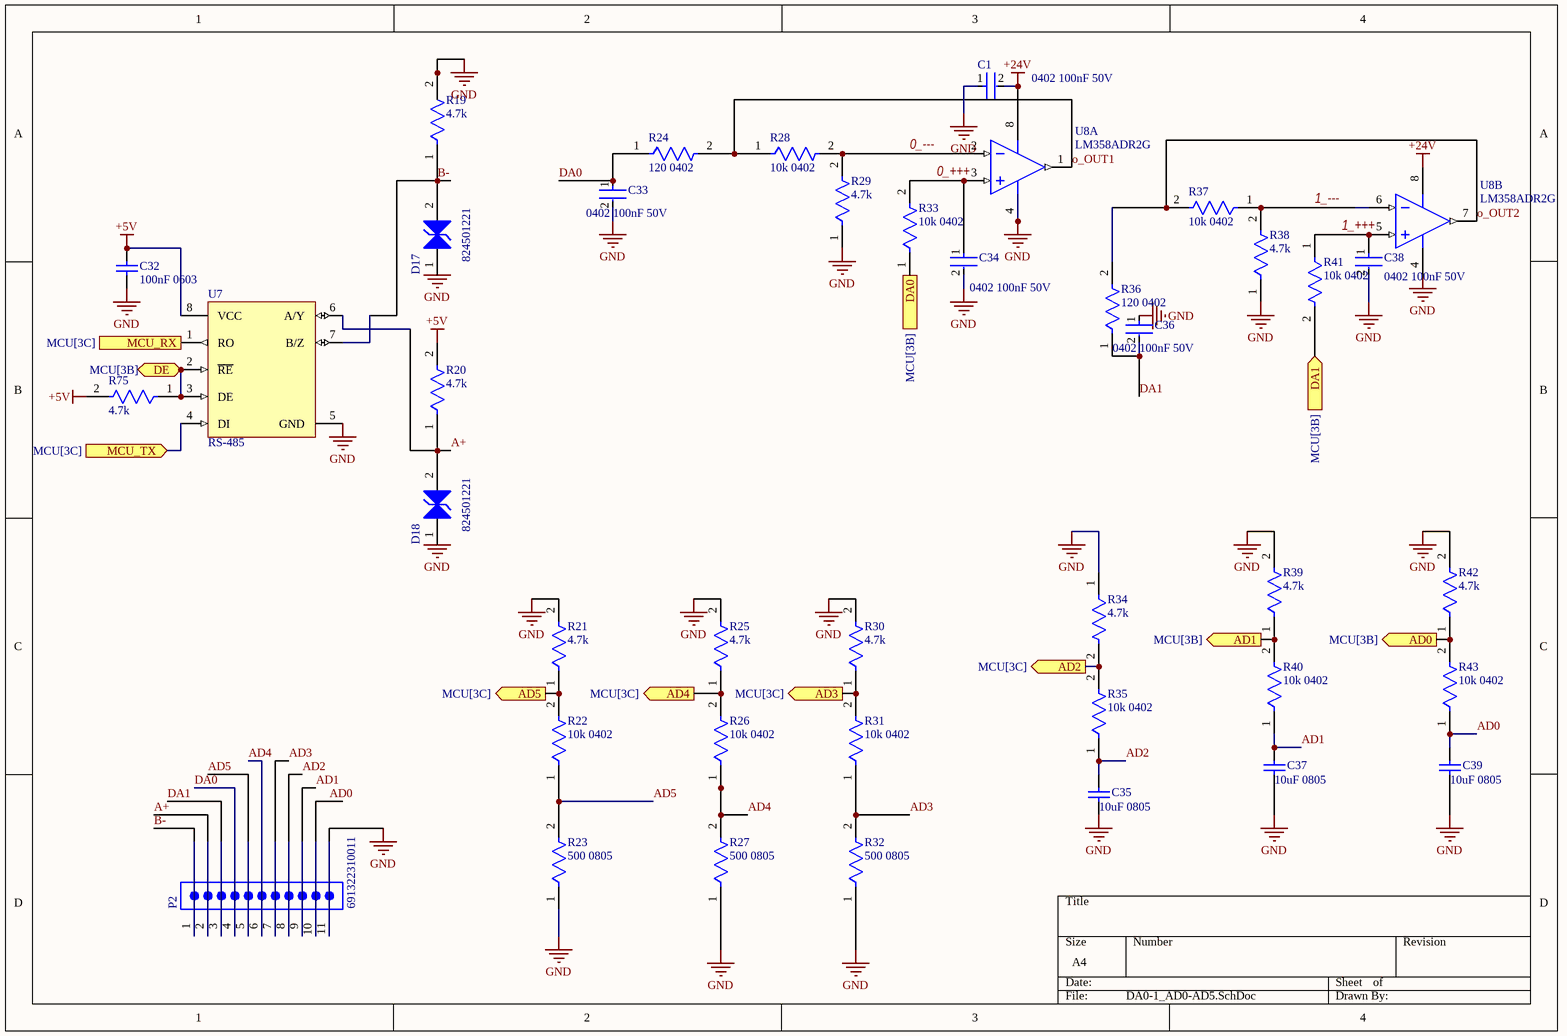
[diagram p4: DA0-1_AD0-AD5.SchDoc]

### Parts
C32  100nF 0603  [CAPC1608X90X35LL15T15]
C33  0402 100nF 50V  [FP-0402B104K500CT-IPC_C]
C34  0402 100nF 50V  [FP-0402B104K500CT-IPC_C]
C35  10uF 0805  [CAPC2013X145X50NL20T25]
C36  0402 100nF 50V  [FP-0402B104K500CT-IPC_C]
C37  10uF 0805  [CAPC2013X145X50NL20T25]
C38  0402 100nF 50V  [FP-0402B104K500CT-IPC_C]
C39  10uF 0805  [CAPC2013X145X50NL20T25]
D17  824501221  [WE-TVSP_DO-214AC_Bidirectional]
D18  824501221  [WE-TVSP_DO-214AC_Bidirectional]
P2  691322310011  [691322310011]
R19  4.7k  [FP-TFCR0402-IPC_A]
R20  4.7k  [FP-TFCR0402-IPC_A]
R21  4.7k  [FP-TFCR0402-IPC_A]
R22  10k 0402  [FP-CRGCQ0402-IPC_C]
R23  500 0805  [FP-RNCF0805-MFG]
R24  120 0402  [FP-RMCF0402-IPC_B]
R25  4.7k  [FP-TFCR0402-IPC_A]
R26  10k 0402  [FP-CRGCQ0402-IPC_C]
R27  500 0805  [FP-RNCF0805-MFG]
R28  10k 0402  [FP-TFCR0402-IPC_B]
R29  4.7k  [FP-TFCR0402-IPC_A]
R30  4.7k  [FP-TFCR0402-IPC_A]
R31  10k 0402  [FP-CRGCQ0402-IPC_C]
R32  500 0805  [FP-RNCF0805-MFG]
R33  10k 0402  [FP-TFCR0402-IPC_B]
R34  4.7k  [FP-TFCR0402-IPC_A]
R35  10k 0402  [FP-CRGCQ0402-IPC_C]
R36  120 0402  [FP-RMCF0402-IPC_B]
R37  10k 0402  [FP-TFCR0402-IPC_B]
R38  4.7k  [FP-TFCR0402-IPC_A]
R39  4.7k  [FP-TFCR0402-IPC_A]
R40  10k 0402  [FP-CRGCQ0402-IPC_C]
R41  10k 0402  [FP-TFCR0402-IPC_B]
R42  4.7k  [FP-TFCR0402-IPC_A]
R43  10k 0402  [FP-CRGCQ0402-IPC_C]
R75  4.7k  [FP-TFCR0402-IPC_A]
U7  RS-485  [SOIC127P600X175-8_M8_15_M]
U8  LM358ADR2G  [ONSC-SOIC-8-751-07_V]  (parts A,B of 2)
С1  0402 100nF 50V  [FP-0402B104K500CT-IPC_C]

### Ports
AD0 (out, see MCU[3B]), AD1 (out, see MCU[3B]), AD2 (out, see MCU[3C]), AD3 (out, see MCU[3C]), AD4 (out, see MCU[3C]), AD5 (out, see MCU[3C]), DA0 (in, see MCU[3B]), DA1 (in, see MCU[3B]), DE (bidir, see MCU[3B]), MCU_RX (out, see MCU[3C]), MCU_TX (in, see MCU[3C])

### Nets
+5V: C32.1 R20.2 R75.2 U7.8(VCC)
+24V: U8.8(VCC) С1.2
GND: C32.2 C33.2 C34.2 C35.1 C36.1 C37.1 C38.2 C39.1 D17.1 D18.1 P2.11 R19.2 R21.2 R23.1 R25.2 R27.1 R29.1 R30.2 R32.1 R34.1 R38.1 R39.2 R42.2 U7.5(GND) U8.4(VEE/GND) С1.1
0_+++: C34.1 R33.2 U8.3(INA+)
0_---: R28.2 R29.2 U8.2(INA-)
1_+++: C38.1 R41.1 U8.5(INB+)
1_---: R37.1 R38.2 U8.6(INB-)
A+: D18.2 P2.2 R20.1 U7.6(A/Y)
AD0: C39.2 P2.10 R43.1
AD1: C37.2 P2.9 R40.1
AD2: C35.2 P2.8 R35.1
AD3: P2.7 R31.1 R32.2
AD4: P2.6 R26.1 R27.2
AD5: P2.5 R22.1 R23.2
B-: D17.2 P2.1 R19.1 U7.7(B/Z)
DA0: C33.1 P2.4 R24.1
DA1: C36.2 P2.3 R36.1
o_OUT1: R24.2 R28.1 U8.1(OUTA)
o_OUT2: R36.2 R37.2 U8.7(OUTB)
SWCLK: R75.1 U7.2(~{RE}) U7.3(DE) ; port DE
NetR21_1: R21.1 R22.2 ; port AD5
NetR25_1: R25.1 R26.2 ; port AD4
NetR30_1: R30.1 R31.2 ; port AD3
NetR33_1: R33.1 ; port DA0
NetR34_2: R34.2 R35.2 ; port AD2
NetR39_1: R39.1 R40.2 ; port AD1
NetR41_2: R41.2 ; port DA1
NetR42_1: R42.1 R43.2 ; port AD0
NetU3_78: U7.4(DI) ; port MCU_TX
NetU3_79: U7.1(RO) ; port MCU_RX

### Library data of the parts
C32 = CMP-2006-04391-1: as C17 on sheet MCU
C33 C34 C36 C38 С1 = CMP-45632-000010-1: as C2 on sheet Power_Supply; Max Operating Temperature: 125°C; Case Code (Metric): 1005; RoHS Compliant: Yes; Series: -; Case Code (Imperial): 0402; Voltage Rating: 50V; Min Operating Temperature: -55°C; Mount: Surface Mount; Capacitance: 100nF; Case/Package: 0402; Packaging: Cut Tape
C35 C37 C39 = CMP-2007-01019-1: Manufacturer: Kemet; Part Number: C0805C106M8PACTU
D17 D18 = CMP-03913-71101551-2: TVS diode [Würth Elektronik] 824501221 TVS diode; Min Breakdown Voltage: 25.65V; Clamping Voltage: 35.5V; Number of Bidirectional Channels: 1; Peak Pulse Current: 11.3A; Reverse Standoff Voltage: 22V; Leakage Current: 1µA; Peak Pulse Power: 400W; Power Line Protection: No; Polarity: Bidirectional; Max Operating Temperature: 150°C; Breakdown Voltage: 25.65V; Packaging: Cut Tape; Length: 4.24mm; Width: 2.67mm; RoHS: Compliant; Min Operating Temperature: -65°C; Max Breakdown Voltage: 25.65V; Composition: Zener; REACH SVHC: Unknown; Height: 2.25mm; Number of Pins: 2; Mount: Surface Mount
P2 = CMP-1502-01895-3: Terminal Block, 3.81MM Pitch, Horizontal Pcb Header, 300VAC, 11 Pins
R19-R21 R25 R29 R30 R34 R38 R39 R42 R75 = CMP-250906-194630-1: as R8 on sheet MCU
R22 R26 R31 R35 R40 R43 = CMP-03211-008081-1: CRGCQ 0402 10K 5%; Manufacturer: TE Connectivity; Manufacturer Part Number: CRGCQ0402J10K; Power Rating: 0.0625W; Tolerance: 0.05; Voltage Rating: 50V; Temperature Coefficient: ±100ppm/°C; Resistance: 10KΩ; Value: 10KΩ; RoHS: TRUE; Octopart: https://octopart.com/crgcq0402j10k-te+connectivity-91017993; ComponentLink2URL: https://www.te.com/commerce/DocumentDelivery/DDEController?Action=showdoc&DocId=Data+Sheet%7F1773204-3%7F1%7Fpdf%7FEnglish%7FENG_DS_1773204-3_1.pdf%7F4-2176347-923; Package: CRGCQ0402; Mouser Description: Res Thick Film 0402 10K Ohm 5% 0.063W(1/16W) ±100ppm/C Pad SMD Automotive T/R; Temperature Range High: +155°C; Composition: Thick Film; Automotive: Yes; Category: Res; Temperature Range Low: -55°C; Height: 0.4mm; Device Class L3: Chip SMD Resistors; Device Class L2: Resistors; Digikey Description: CRGCQ 0402 10K 5%; Ambient Temperature Range High: +70°C; Device Class L1: Passive Components; Lead Free: Yes; ComponentLink2Description: Datasheet; Temperature: -55°C to +155°C; Series: CRGCQ; Ipc Land Pattern Name: RESC10050X35
R23 R27 R32 = CMP-00347-25743669-1: RNCF0805TKY500R RNCF Precision Thin Film Chip Resistor 0805 Size 500 Ohm 0.01% 0.125 W 5 ppm/°C 2-Pin SMD T/R; Voltage Rating: 150V; Power Rating: 125mW; Resistance: 500Ω; Max Operating Temperature: 155°C; Composition: Thin Film; Min Operating Temperature: -55°C; Temperature Coefficient: 5ppm/°C; Case/Package: 0805; NexarPartId: 25743669; Mount: Surface Mount; Height: 650µm; Tolerance: 0.01%; RoHS: Non-Compliant
R24 R36 = CMP-26527-003696-1: 120Ω ±1% 0.063W 0402 Thick Film Chip Resistor AEC-Q200 compliant; Max Power Dissipation: 63mW; Resistance: 120R; Temperature Coefficient: 100ppm/°C; RoHS Compliant: Yes; Height: 0.016inch; Radiation Hardening: No; Case Code (Imperial): 0402; Case/Package: 0402; Min Operating Temperature: -55°C; Mount: Surface Mount; Contact Plating: Tin; Resistor Type: Thick Film; Tolerance: 1%; Case Code (Metric): 1005; Number of Terminations: 2; Max Operating Temperature: 155°C; Width: 0.02inch; Series: RMCF; Length: 0.039inch; Package Quantity: 10000; Packaging: Tape and Reel; Features: Automotive AEC-Q200
R28 R33 R37 R41 = CMP-250906-284563-1: RES Thin Film,  10kΩ, 0.1%, 0.063W, 25ppm/°C, 0402; RoHS Compliant: Yes
U7 = CMP-00572-88282978-3: Single Transmitter/Receiver RS-422/RS-485 8-Pin SOIC N T/R; Manufacturer Lifecycle Status: ACTIVE; Number of Transmitters: 1; RAM Size: 48kB; Data Rate: 115kbps; Simplex/Duplex: Half Duplex; Operating Supply Voltage: 5V; Interface: RS-422, RS-485; Min Supply Voltage: 4.5V; ESD Protection: Yes; Pitch: 1.3mm; Max Supply Voltage: 5.5V; Logic Function: Transceiver; Max Junction Temperature (Tj): 150°C; Export Control Classification Number (ECCN) Code: EAR99; Width: 3.9mm; Number of Receivers: 1; Min Operating Temperature: -40°C; Lifecycle Status: Production; Mount: Surface Mount; Height: 0m; Case/Package: SOIC; ComponentLink2URL: https://octopart.com/cad-content/api/get-model-datasheet/15189/88282978; RoHS: Compliant; HelpURL: https://octopart.com/cad-content/api/get-model-datasheet/15189/88282978; ComponentLink2Description: Datasheet URL; ComponentLink1URL: http://www.renesas.com; Number of Pins: 8; Length: 4.9mm; ComponentLink1Description: Manufacturer's Website; Number of Drivers: 1; ComponentLink3Description: Manufacturer's Package Drawing; Max Operating Temperature: 85°C; ComponentLink3URL: https://www.renesas.com/en/document/psc/m815-8-lead-narrow-body-small-outline-plastic-package
U8 = CMP-1310-00289-1: Single Supply Dual Operational Amplifier, 3 to 32 V, 0 to 70 degC, 8-Pin SOIC, Pb-Free, Tape and Reel; Manufacturer: On Semiconductor; VCC Min (V): 3; VCC Max (V): 32; DatasheetVersion: Rev. 27; ComponentLink1URL: http://www.onsemi.com/; PackageVersion: Rev. AK, 02/2011; Packing: Tape and Reel; ComponentLink3URL: http://www.onsemi.com/pub_link/Collateral/751-07.PDF; ComponentLink2URL: http://www.onsemi.cn/pub_link/Collateral/LM358-D.PDF; Mounting Technology: Surface Mount; PackageReference: SOIC-8-751-07; PackageDescription: 8-Pin Small Outline Integrated Circuit, Body 4.9 x 3.9 mm, Pitch 1.27 mm; ComponentLink3Description: Package Specification; ComponentLink2Description: Datasheet; RoHS: TRUE; ComponentLink1Description: Manufacturer URL; PartNumber: LM358ADR2G